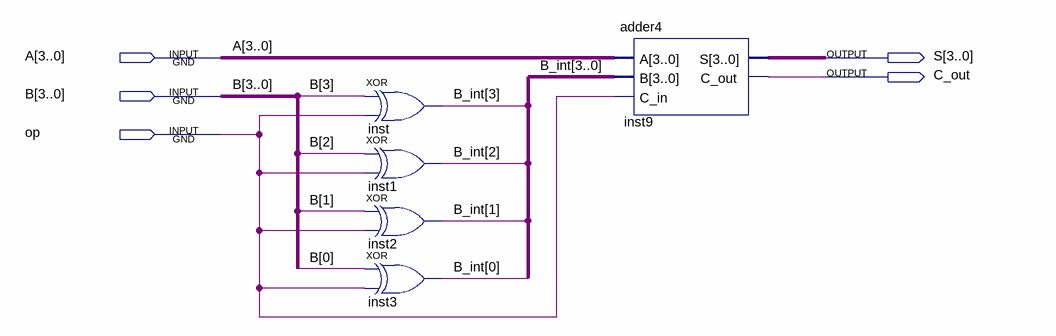
[diagram p0: schematic sheet]
// Quartus schematic alu.bdf as structural Verilog: 5 symbols, 5 pins
module alu (
  input  [3:0] A,
  input  [3:0] B,
  input  op,
  output [3:0] S,
  output C_out
);

  wire [3:0] B_int;

  xor inst (B_int[3], B[3], op);
  xor inst1 (B_int[2], B[2], op);
  xor inst2 (B_int[1], B[1], op);
  xor inst3 (B_int[0], B[0], op);
  adder4 inst9 (.A(A), .B(B_int), .C_in(op), .S(S), .C_out(C_out));
endmodule
